# Altium schematic sheet usb-can_schematic.SchDoc
size A2
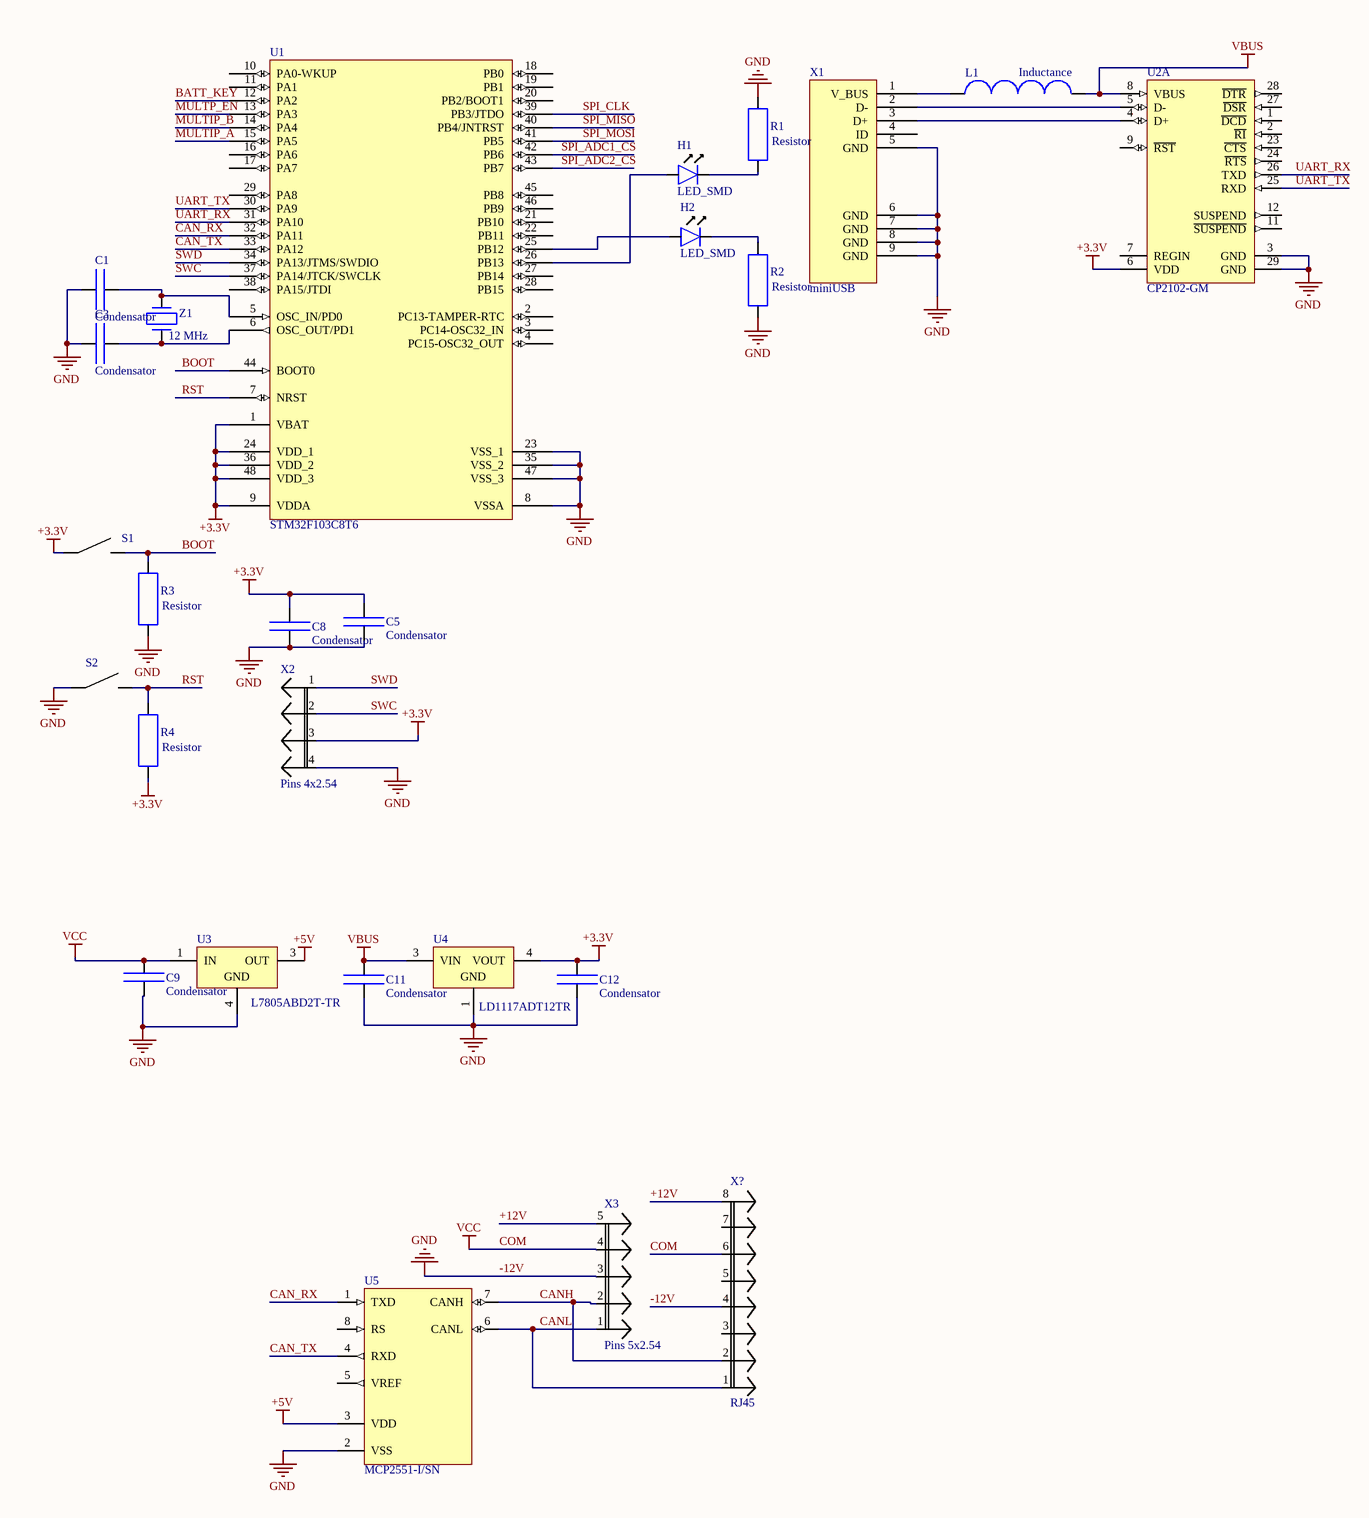
[diagram p0: usb-can_schematic.SchDoc]

## Parts
C1  Condensator  [C0805]
C3  Condensator  [C0805]
C5  Condensator  [C0805]
C8  Condensator  [C0805]
C9  Condensator  [C0805]
C11  Condensator  [C0805]
C12  Condensator  [C0805]
H1  LED_SMD  [C0805]
H2  LED_SMD  [C0805]
L1  Inductance  [L0805]
R1  Resistor  [R0805]
R2  Resistor  [R0805]
R3  Resistor  [R0805]
R4  Resistor  [R0805]
S1  Tact_switch  [Tact_switch_smd]  (value not drawn)
S2  Tact_switch  [Tact_switch_smd]  (value not drawn)
U1  STM32F103C8T6  [LQFP48_N]
U2  CP2102-GM  [SLAB-QFN-28-3125x3125TP_N]  (part A of 2)
U3  L7805ABD2T-TR  [TO-263_N]
U4  LD1117ADT12TR  [TO-252_N]
U5  MCP2551-I/SN  [SOIC-SN8_N]
X1  miniUSB  [miniUSB]
X2  Pins 4x2.54  [Pins 4x2.54]
X3  Pins 5x2.54  [Pins 5x2.54]
X?  RJ45  [RJ45]
Z1  12 MHz  [kx 13 12MHz]

## Nets
+3.3V: C5.2 C8.2 C12.1 R4.1 S1.1 U1.1(VBAT) U1.9(VDDA) U1.24(VDD_1) U1.36(VDD_2) U1.48(VDD_3) U2.6(VDD) U4.4(VOUT) X2.3
+5V: U3.3(OUT) U5.3(VDD)
-12V: C1.2 C3.2 C5.1 C8.1 C9.2 C11.2 C12.2 R1.2 R2.1 R3.1 S2.1 U1.8(VSSA) U1.23(VSS_1) U1.35(VSS_2) U1.47(VSS_3) U2.3(GND) U2.29(GND) U3.4(GND) U4.1(GND) U5.2(VSS) X1.5(GND) X1.6(GND) X1.7(GND) X1.8(GND) X1.9(GND) X2.4 X3.3 X?.4  [also labelled GND]
COM: C9.1 U3.1(IN) X3.4 X?.6  [also labelled VCC]
VBUS: C11.1 L1.2 U2.8(VBUS) U4.3(VIN)
+12V: X3.5 X?.8
BATT_KEY: U1.12(PA2)
BOOT: R3.2 S1.2 U1.44(BOOT0)
CAN_RX: U1.32(PA11) U5.1(TXD)
CAN_TX: U1.33(PA12) U5.4(RXD)
CANH: U5.7(CANH) X3.2 X?.2
CANL: U5.6(CANL) X3.1 X?.1
MULTIP_A: U1.15(PA5)
MULTIP_B: U1.14(PA4)
MULTP_EN: U1.13(PA3)
RST: R4.2 S2.2 U1.7(NRST)
SPI_ADC1_CS: U1.42(PB6)
SPI_ADC2_CS: U1.43(PB7)
SPI_CLK: U1.39(PB3/JTDO)
SPI_MISO: U1.40(PB4/JNTRST)
SPI_MOSI: U1.41(PB5)
SWC: U1.37(PA14/JTCK/SWCLK) X2.2
SWD: U1.34(PA13/JTMS/SWDIO) X2.1
UART_RX: U1.31(PA10) U2.26(TXD)
UART_TX: U1.30(PA9) U2.25(RXD)
NetC1_1: C1.1 U1.5(OSC_IN/PD0) Z1.1
NetC3_1: C3.1 U1.6(OSC_OUT/PD1) Z1.3
NetH1_1: H1.1 U1.26(PB13)
NetH1_2: H1.2 R1.1
NetH2_1: H2.1 U1.25(PB12)
NetH2_2: H2.2 R2.2
NetL1_1: L1.1 X1.1(V_BUS)
NetU2_4: U2.4(D+) X1.3(D+)
NetU2_5: U2.5(D-) X1.2(D-)

Not connected (* = marked no-connect by the designer): U1 2(PC13-TAMPER-RTC) 3(PC14-OSC32_IN) 4(PC15-OSC32_OUT) 10(PA0-WKUP) 11(PA1) 16(PA6) 17(PA7) 18(PB0) 19(PB1) 20(PB2/BOOT1) 21(PB10) 22(PB11) 27(PB14) 28(PB15) 29(PA8) 38(PA15/JTDI) 45(PB8) 46(PB9); U2 1(~{DCD}) 2(~{RI}) 7(REGIN) 9(~{RST}) 11(~{SUSPEND}) 12(SUSPEND) 23(~{CTS}) 24(~{RTS}) 27(~{DSR}) 28(~{DTR}); U5 5(VREF) 8(RS); X1 4(ID); X? 3 5 7

## Library data of the parts
U1 = STM32F103C8T6: STM32 ARM-based 32-bit MCU with 64 Kbytes Flash, 48-pin LQFP, Industrial Temperature; Published: 30-May-2008; DatasheetVersion: rev6, Mar-2008; PackageVersion: Mar-2008; PackageReference: LQFP48; Publisher: Altium Limited; PackageDescription: 48-Pin Low-Profile Quad Flat Pack, 7 x 7 mm Body, 0.5 mm Pitch (LQFP48); ComponentLink1Description: Manufacturer Link; ComponentLink1URL: www.st.com/stm32; ComponentLink2Description: Datasheet; ComponentLink2URL: http://www.st.com/stonline/products/literature/ds/13587.pdf
U2 = CP2102-GM: Single-Chip USB to UART Bridge, 1024 Bytes EEPROM, -40 to 85 degC, 28-pin QFN, Tube; Manufacturer: Silicon Labs; Internal Oscillator: TRUE; Sub-Family: USB Bridges; DatasheetVersion: Rev. 1.5; PackageReference: QFN-28; PackageDescription: 28-Pin Quad-Flat No-Leads Package, Body 5 x 5 mm, Pitch 0.5 mm; Supplier 1: Digi-Key; Supplier Part Number 1: 336-1160-5-ND; Supplier 2: Farnell; Supplier Part Number 2: 9282130; Supplier 3: Newark; Supplier Part Number 3: 30K5635; Supplier 4: Mouser; Supplier Part Number 4: 634-CP2102-GM; EEPROM: 1024 Bytes; Mounting Technology: Surface Mount; Code_JEDEC: MO-220; Code_IPC: J-STD-020C; PartNumber: CP2102-GM; ComponentLink1Description: Manufacturer URL; ComponentLink1URL: http://www.silabs.com/; ComponentLink2Description: Datasheet; ComponentLink2URL: http://www.silabs.com/Support%20Documents/TechnicalDocs/CP2102-9.pdf; ComponentLink3Description: Package Specification; ComponentLink3URL: http://www.silabs.com/Support%20Documents/TechnicalDocs/C8051T61x.pdf
U3 = L7805ABD2T-TR: Positive Voltage Regulator, 3-Pin D2PAK, Tape and Reel; DatasheetVersion: Nov-2011; PackageVersion: 2011; PackageReference: TO-263; PackageDescription: 3-Pin Transistor Outline Package 2.54 mm Pitch, 15.4 mm Lead Span (D2PAK); PartNumber: L7805ABD2T-TR; ComponentLink1Description: Manufacturer URL; ComponentLink1URL: http://www.st.com; ComponentLink2Description: Datasheet; ComponentLink2URL: http://www.st.com/internet/com/TECHNICAL_RESOURCES/TECHNICAL_LITERATURE/DATASHEET/CD00000444.pdf
U4 = LD1117ADT12TR: 1A, Low Drop Positive Voltage Regulator, 1.2V, 3-Pin DPAK, Tape and Reel; DatasheetVersion: Dec-2011; PackageVersion: 2011; PackageReference: TO-252; PackageDescription: 3-Pin Transistor Outline Package 2.28 mm Pitch, 9.7 mm Lead Span (DPAK); PartNumber: LD1117ADT12TR; ComponentLink1Description: Manufacturer URL; ComponentLink1URL: http://www.st.com; ComponentLink2Description: Datasheet; ComponentLink2URL: http://www.st.com/internet/com/TECHNICAL_RESOURCES/TECHNICAL_LITERATURE/DATASHEET/CD00002116.pdf
U5 = MCP2551-I/SN: High-Speed CAN Transceiver, 8-Pin SOIC, Industrial Temperature; Published: 29-Jan-2009; DatasheetVersion: revE, Jan-2007; PackageVersion: revBB, Aug-2009; PackageReference: SOIC-SN8; Publisher: Altium Limited; PackageDescription: 8-Lead Plastic Small Outline (SN) - Narrow, 3.90mm Body [SOIC]; Supplier 1: Digi-Key; Supplier Part Number 1: MCP2551-I/SN-ND; Supplier 2: Farnell; Supplier Part Number 2: 9758569; Code_JEDEC: MS-012; Code_IPC: SOIC127P600-8; ComponentLink1Description: Datasheet; ComponentLink1URL: http://ww1.microchip.com/downloads/en/DeviceDoc/21667E.pdf; ComponentLink2Description: Packaging Specification; ComponentLink2URL: http://www.microchip.com/stellent/groups/techpub_sg/documents/packagingspec/en012702.pdf; ComponentLink3Description: Microchip.com Home; ComponentLink3URL: http://www.microchip.com/
Z1 = KX 13 Geyer